# Altium schematic sheet HTtransitorio.SchDoc
size Letter; SheetNumber: 4; SheetTotal: 4
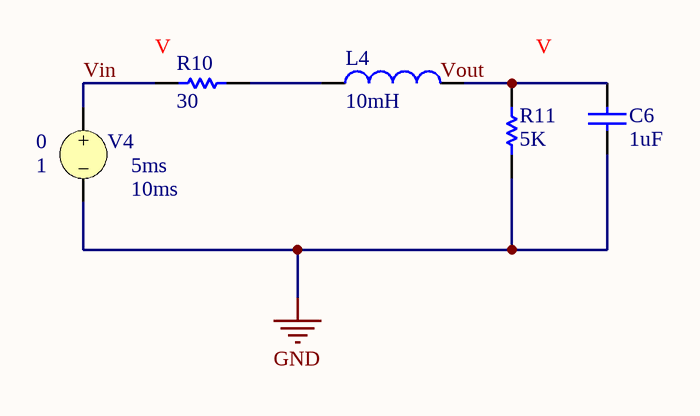
[diagram p0: HTtransitorio.SchDoc]

## Parts
C6  value 1uF  (hidden comment: Capacitor)
L4  value 10mH  (hidden comment: Inductor)
R10  value 30  (hidden comment: Resistor)
R11  value 5K  (hidden comment: Resistor)
V4  Initial Value: 0  Pulsed Value: 1  Pulse Width: 5ms  Period: 10ms  (hidden comment: PULSE(0 1 100n 10n 10n 5ms 10ms 0))

## Nets
GND: C6.1 R11.2 V4.2
Vin: R10.2 V4.1
NetC6_2: C6.2 L4.2 R11.1
NetL4_1: L4.1 R10.1

## Notes on the sheet
- Labels drawn without touching a wire or pin: Vout
- Proyecto:
- Documento:
- Autor:
- Carnet:
- Fecha:
- Revisión:
- Curso:
- Tamaño:
- Hoja:
- de
- Carta

## Library data of the parts
C6 = Capacitor: SimulationGenericComponent: True
L4 = Inductor: SimulationGenericComponent: True
R10 R11 = Resistor: TC1: 0; SimulationGenericComponent: True; TC2: 0
V4 = VSRC: Voltage Source; Note: PCB Footprint - Not required; DC Magnitude: 5; Published: 8-Jun-2000; LatestRevisionDate: 17-Jul-2002; LatestRevisionNote: Re-released for DXP Platform.; PackageReference: Not Applicable; Publisher: Altium Limited; AC Magnitude: 1; AC Phase: 0; Time Delay: 100n; Rise Time: 10n; Fall Time: 10n; Phase: 0